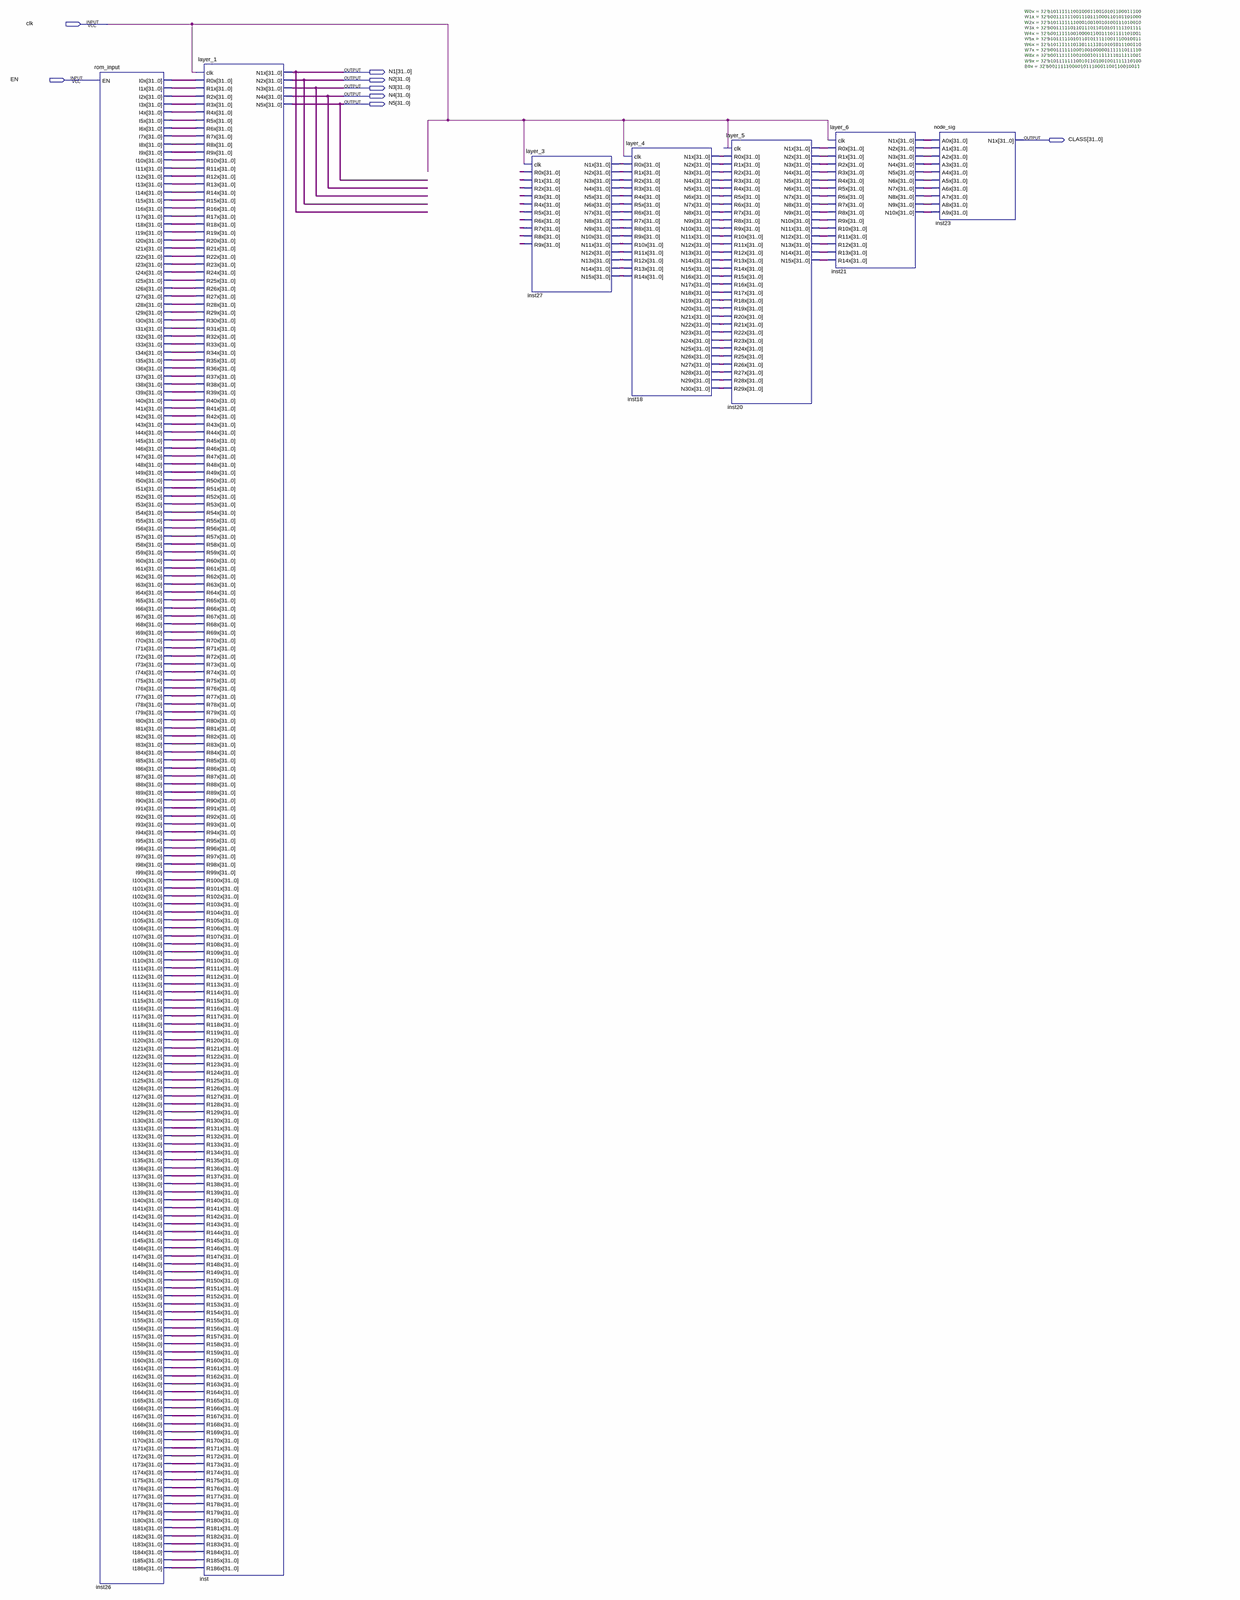
[diagram p0: schematic sheet, whole]
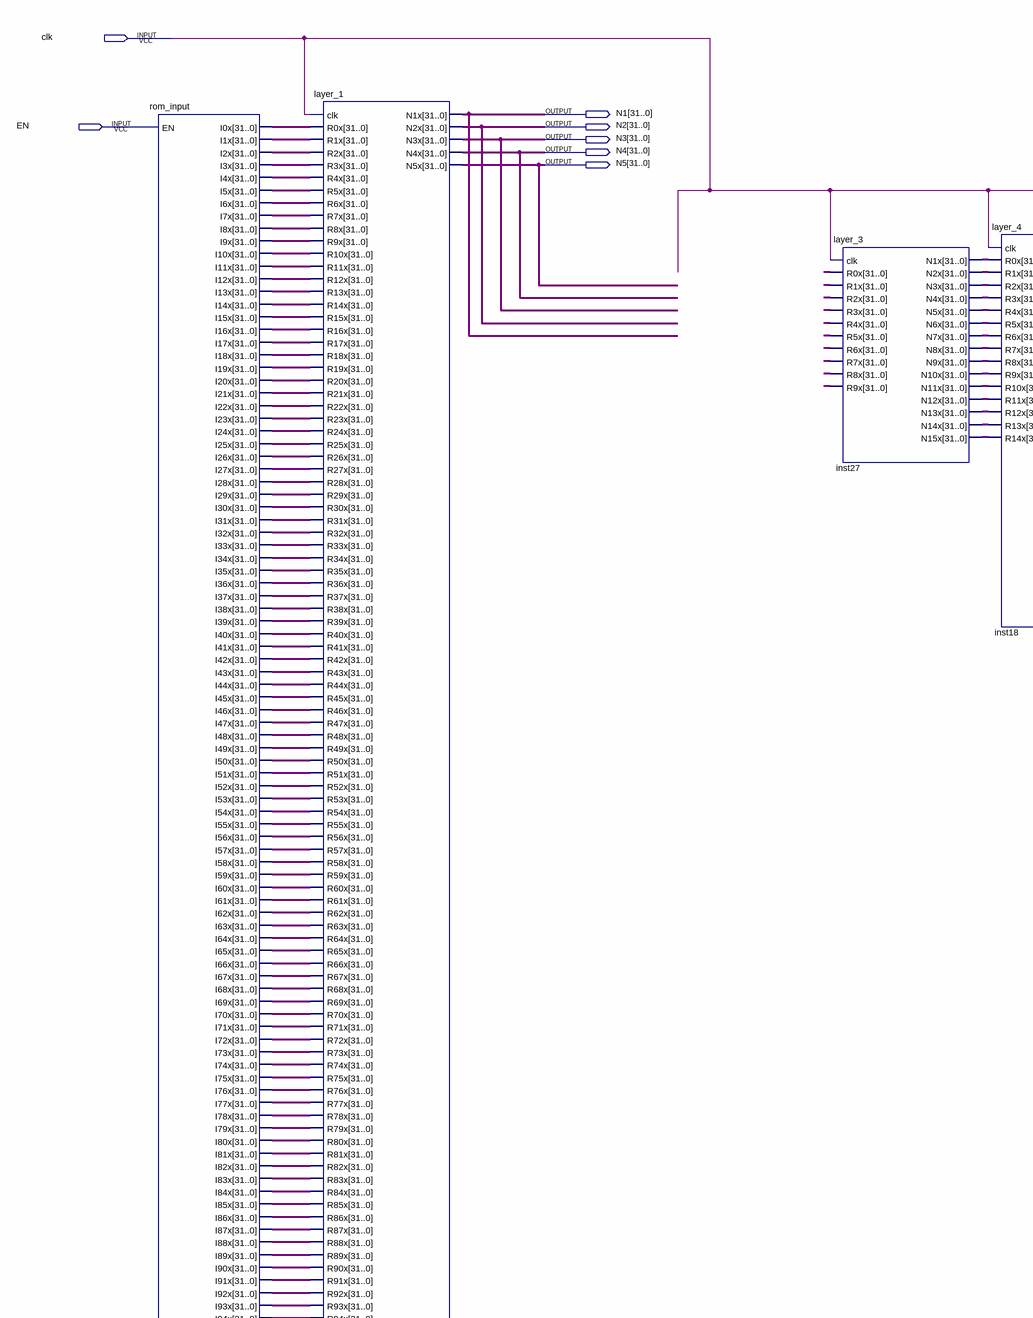
[diagram p1: schematic sheet, upper left part]
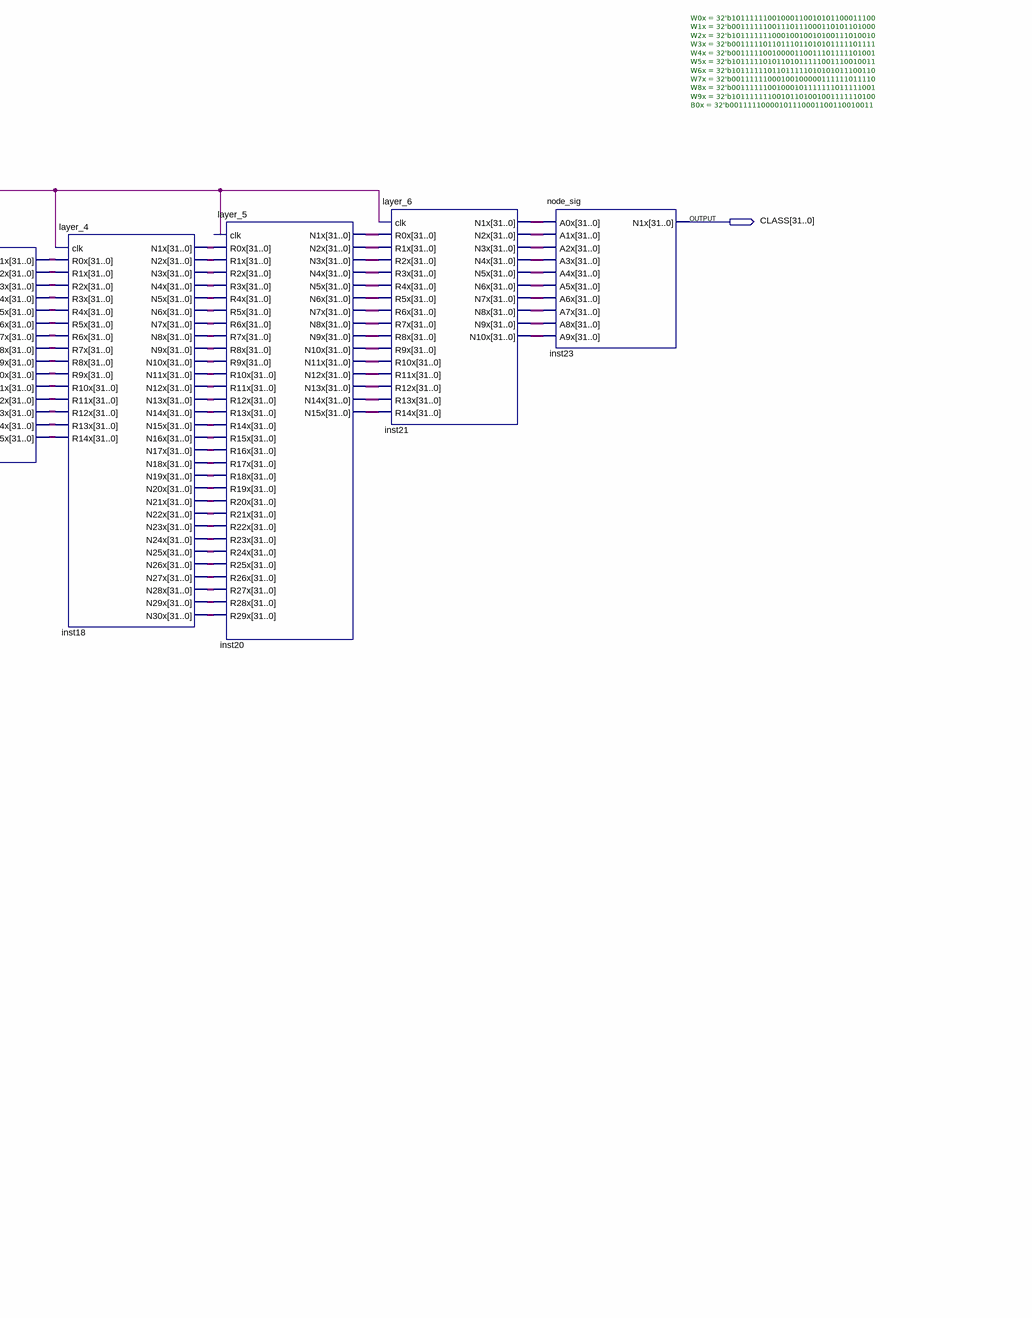
[diagram p2: schematic sheet, upper right part]
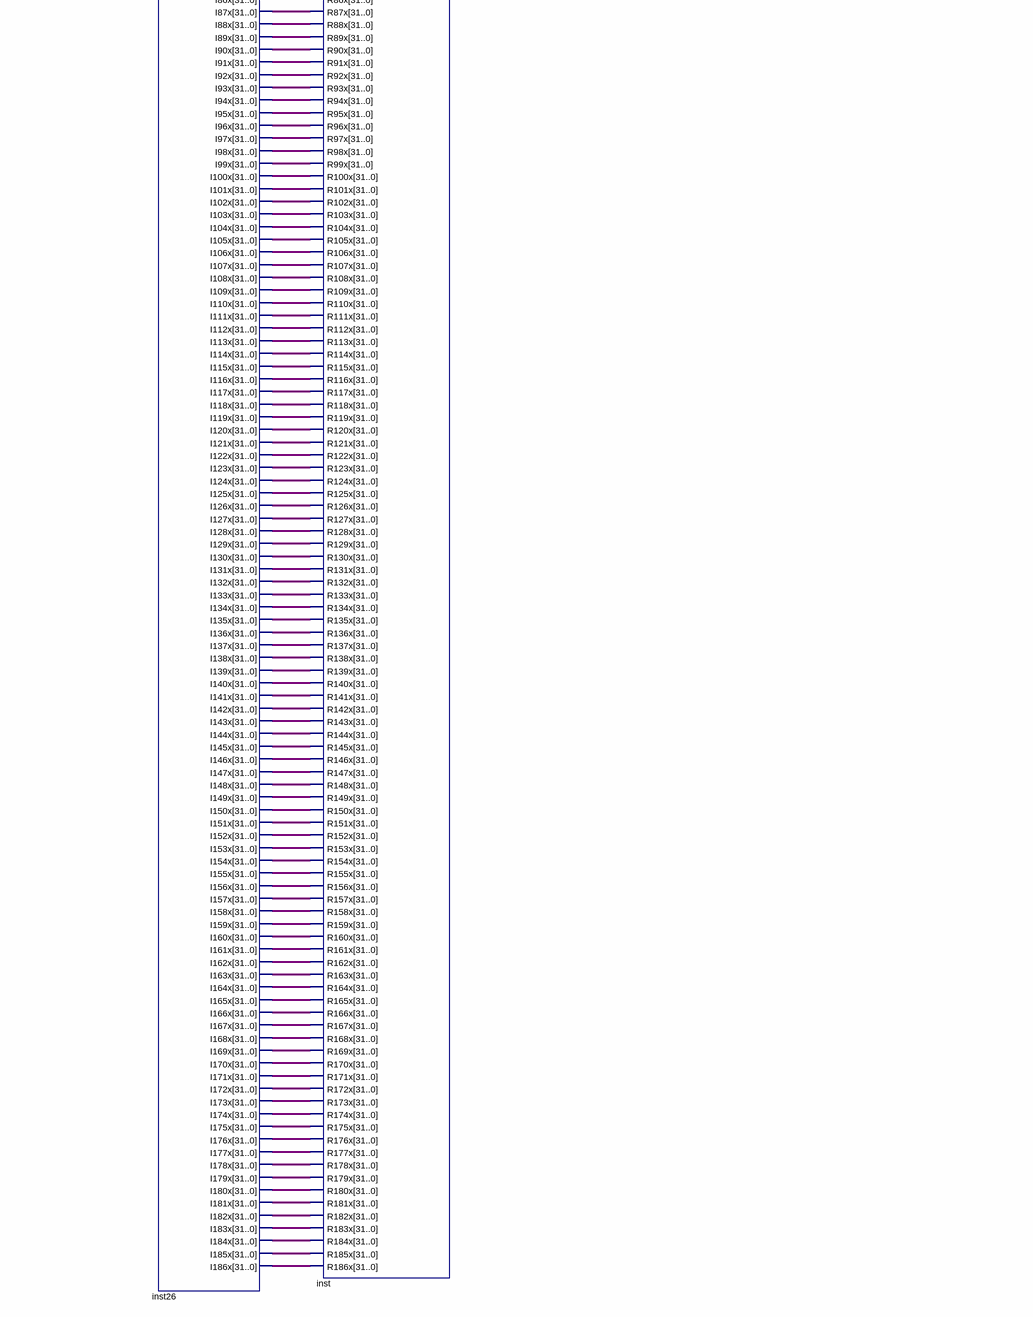
[diagram p3: schematic sheet, lower left part]
// Quartus schematic neural_net_top.bdf as structural Verilog: 7 symbols, 8 pins
module neural_net_top (
  input  clk,
  input  EN,
  output [31:0] N1,
  output [31:0] N2,
  output [31:0] N3,
  output [31:0] N4,
  output [31:0] N5,
  output [31:0] CLASS
);

  wire [31:0] inst18_n1x, inst18_n2x, inst18_n3x, inst18_n4x, inst18_n5x, inst18_n6x, inst18_n7x, inst18_n8x,
       inst18_n9x, inst18_n10x, inst18_n11x, inst18_n12x, inst18_n13x, inst18_n14x, inst18_n15x, inst18_n16x,
       inst18_n17x, inst18_n18x, inst18_n19x, inst18_n20x, inst18_n21x, inst18_n22x, inst18_n23x,
       inst18_n24x, inst18_n25x, inst18_n26x, inst18_n27x, inst18_n28x, inst18_n29x, inst18_n30x, inst20_n1x,
       inst20_n2x, inst20_n3x, inst20_n4x, inst20_n5x, inst20_n6x, inst20_n7x, inst20_n8x, inst20_n9x,
       inst20_n10x, inst20_n11x, inst20_n12x, inst20_n13x, inst20_n14x, inst20_n15x, inst21_n1x, inst21_n2x,
       inst21_n3x, inst21_n4x, inst21_n5x, inst21_n6x, inst21_n7x, inst21_n8x, inst21_n9x, inst21_n10x,
       inst26_i0x, inst26_i1x, inst26_i2x, inst26_i3x, inst26_i4x, inst26_i5x, inst26_i6x, inst26_i7x,
       inst26_i8x, inst26_i9x, inst26_i10x, inst26_i11x, inst26_i12x, inst26_i13x, inst26_i14x, inst26_i15x,
       inst26_i16x, inst26_i17x, inst26_i18x, inst26_i19x, inst26_i20x, inst26_i21x, inst26_i22x,
       inst26_i23x, inst26_i24x, inst26_i25x, inst26_i26x, inst26_i27x, inst26_i28x, inst26_i29x,
       inst26_i30x, inst26_i31x, inst26_i32x, inst26_i33x, inst26_i34x, inst26_i35x, inst26_i36x,
       inst26_i37x, inst26_i38x, inst26_i39x, inst26_i40x, inst26_i41x, inst26_i42x, inst26_i43x,
       inst26_i44x, inst26_i45x, inst26_i46x, inst26_i47x, inst26_i48x, inst26_i49x, inst26_i50x,
       inst26_i51x, inst26_i52x, inst26_i53x, inst26_i54x, inst26_i55x, inst26_i56x, inst26_i57x,
       inst26_i58x, inst26_i59x, inst26_i60x, inst26_i61x, inst26_i62x, inst26_i63x, inst26_i64x,
       inst26_i65x, inst26_i66x, inst26_i67x, inst26_i68x, inst26_i69x, inst26_i70x, inst26_i71x,
       inst26_i72x, inst26_i73x, inst26_i74x, inst26_i75x, inst26_i76x, inst26_i77x, inst26_i78x,
       inst26_i79x, inst26_i80x, inst26_i81x, inst26_i82x, inst26_i83x, inst26_i84x, inst26_i85x,
       inst26_i86x, inst26_i87x, inst26_i88x, inst26_i89x, inst26_i90x, inst26_i91x, inst26_i92x,
       inst26_i93x, inst26_i94x, inst26_i95x, inst26_i96x, inst26_i97x, inst26_i98x, inst26_i99x,
       inst26_i100x, inst26_i101x, inst26_i102x, inst26_i103x, inst26_i104x, inst26_i105x, inst26_i106x,
       inst26_i107x, inst26_i108x, inst26_i109x, inst26_i110x, inst26_i111x, inst26_i112x, inst26_i113x,
       inst26_i114x, inst26_i115x, inst26_i116x, inst26_i117x, inst26_i118x, inst26_i119x, inst26_i120x,
       inst26_i121x, inst26_i122x, inst26_i123x, inst26_i124x, inst26_i125x, inst26_i126x, inst26_i127x,
       inst26_i128x, inst26_i129x, inst26_i130x, inst26_i131x, inst26_i132x, inst26_i133x, inst26_i134x,
       inst26_i135x, inst26_i136x, inst26_i137x, inst26_i138x, inst26_i139x, inst26_i140x, inst26_i141x,
       inst26_i142x, inst26_i143x, inst26_i144x, inst26_i145x, inst26_i146x, inst26_i147x, inst26_i148x,
       inst26_i149x, inst26_i150x, inst26_i151x, inst26_i152x, inst26_i153x, inst26_i154x, inst26_i155x,
       inst26_i156x, inst26_i157x, inst26_i158x, inst26_i159x, inst26_i160x, inst26_i161x, inst26_i162x,
       inst26_i163x, inst26_i164x, inst26_i165x, inst26_i166x, inst26_i167x, inst26_i168x, inst26_i169x,
       inst26_i170x, inst26_i171x, inst26_i172x, inst26_i173x, inst26_i174x, inst26_i175x, inst26_i176x,
       inst26_i177x, inst26_i178x, inst26_i179x, inst26_i180x, inst26_i181x, inst26_i182x, inst26_i183x,
       inst26_i184x, inst26_i185x, inst26_i186x, inst27_n1x, inst27_n2x, inst27_n3x, inst27_n4x, inst27_n5x,
       inst27_n6x, inst27_n7x, inst27_n8x, inst27_n9x, inst27_n10x, inst27_n11x, inst27_n12x, inst27_n13x,
       inst27_n14x, inst27_n15x, undriven, undriven_2, undriven_3, undriven_4, undriven_5, undriven_6,
       undriven_7, undriven_8, undriven_9, undriven_10;

  rom_input inst26 (
    .EN(EN), .I0x(inst26_i0x), .I1x(inst26_i1x), .I2x(inst26_i2x), .I3x(inst26_i3x), .I4x(inst26_i4x),
    .I5x(inst26_i5x), .I6x(inst26_i6x), .I7x(inst26_i7x), .I8x(inst26_i8x), .I9x(inst26_i9x),
    .I10x(inst26_i10x), .I11x(inst26_i11x), .I12x(inst26_i12x), .I13x(inst26_i13x), .I14x(inst26_i14x),
    .I15x(inst26_i15x), .I16x(inst26_i16x), .I17x(inst26_i17x), .I18x(inst26_i18x), .I19x(inst26_i19x),
    .I20x(inst26_i20x), .I21x(inst26_i21x), .I22x(inst26_i22x), .I23x(inst26_i23x), .I24x(inst26_i24x),
    .I25x(inst26_i25x), .I26x(inst26_i26x), .I27x(inst26_i27x), .I28x(inst26_i28x), .I29x(inst26_i29x),
    .I30x(inst26_i30x), .I31x(inst26_i31x), .I32x(inst26_i32x), .I33x(inst26_i33x), .I34x(inst26_i34x),
    .I35x(inst26_i35x), .I36x(inst26_i36x), .I37x(inst26_i37x), .I38x(inst26_i38x), .I39x(inst26_i39x),
    .I40x(inst26_i40x), .I41x(inst26_i41x), .I42x(inst26_i42x), .I43x(inst26_i43x), .I44x(inst26_i44x),
    .I45x(inst26_i45x), .I46x(inst26_i46x), .I47x(inst26_i47x), .I48x(inst26_i48x), .I49x(inst26_i49x),
    .I50x(inst26_i50x), .I51x(inst26_i51x), .I52x(inst26_i52x), .I53x(inst26_i53x), .I54x(inst26_i54x),
    .I55x(inst26_i55x), .I56x(inst26_i56x), .I57x(inst26_i57x), .I58x(inst26_i58x), .I59x(inst26_i59x),
    .I60x(inst26_i60x), .I61x(inst26_i61x), .I62x(inst26_i62x), .I63x(inst26_i63x), .I64x(inst26_i64x),
    .I65x(inst26_i65x), .I66x(inst26_i66x), .I67x(inst26_i67x), .I68x(inst26_i68x), .I69x(inst26_i69x),
    .I70x(inst26_i70x), .I71x(inst26_i71x), .I72x(inst26_i72x), .I73x(inst26_i73x), .I74x(inst26_i74x),
    .I75x(inst26_i75x), .I76x(inst26_i76x), .I77x(inst26_i77x), .I78x(inst26_i78x), .I79x(inst26_i79x),
    .I80x(inst26_i80x), .I81x(inst26_i81x), .I82x(inst26_i82x), .I83x(inst26_i83x), .I84x(inst26_i84x),
    .I85x(inst26_i85x), .I86x(inst26_i86x), .I87x(inst26_i87x), .I88x(inst26_i88x), .I89x(inst26_i89x),
    .I90x(inst26_i90x), .I91x(inst26_i91x), .I92x(inst26_i92x), .I93x(inst26_i93x), .I94x(inst26_i94x),
    .I95x(inst26_i95x), .I96x(inst26_i96x), .I97x(inst26_i97x), .I98x(inst26_i98x), .I99x(inst26_i99x),
    .I100x(inst26_i100x), .I101x(inst26_i101x), .I102x(inst26_i102x), .I103x(inst26_i103x),
    .I104x(inst26_i104x), .I105x(inst26_i105x), .I106x(inst26_i106x), .I107x(inst26_i107x),
    .I108x(inst26_i108x), .I109x(inst26_i109x), .I110x(inst26_i110x), .I111x(inst26_i111x),
    .I112x(inst26_i112x), .I113x(inst26_i113x), .I114x(inst26_i114x), .I115x(inst26_i115x),
    .I116x(inst26_i116x), .I117x(inst26_i117x), .I118x(inst26_i118x), .I119x(inst26_i119x),
    .I120x(inst26_i120x), .I121x(inst26_i121x), .I122x(inst26_i122x), .I123x(inst26_i123x),
    .I124x(inst26_i124x), .I125x(inst26_i125x), .I126x(inst26_i126x), .I127x(inst26_i127x),
    .I128x(inst26_i128x), .I129x(inst26_i129x), .I130x(inst26_i130x), .I131x(inst26_i131x),
    .I132x(inst26_i132x), .I133x(inst26_i133x), .I134x(inst26_i134x), .I135x(inst26_i135x),
    .I136x(inst26_i136x), .I137x(inst26_i137x), .I138x(inst26_i138x), .I139x(inst26_i139x),
    .I140x(inst26_i140x), .I141x(inst26_i141x), .I142x(inst26_i142x), .I143x(inst26_i143x),
    .I144x(inst26_i144x), .I145x(inst26_i145x), .I146x(inst26_i146x), .I147x(inst26_i147x),
    .I148x(inst26_i148x), .I149x(inst26_i149x), .I150x(inst26_i150x), .I151x(inst26_i151x),
    .I152x(inst26_i152x), .I153x(inst26_i153x), .I154x(inst26_i154x), .I155x(inst26_i155x),
    .I156x(inst26_i156x), .I157x(inst26_i157x), .I158x(inst26_i158x), .I159x(inst26_i159x),
    .I160x(inst26_i160x), .I161x(inst26_i161x), .I162x(inst26_i162x), .I163x(inst26_i163x),
    .I164x(inst26_i164x), .I165x(inst26_i165x), .I166x(inst26_i166x), .I167x(inst26_i167x),
    .I168x(inst26_i168x), .I169x(inst26_i169x), .I170x(inst26_i170x), .I171x(inst26_i171x),
    .I172x(inst26_i172x), .I173x(inst26_i173x), .I174x(inst26_i174x), .I175x(inst26_i175x),
    .I176x(inst26_i176x), .I177x(inst26_i177x), .I178x(inst26_i178x), .I179x(inst26_i179x),
    .I180x(inst26_i180x), .I181x(inst26_i181x), .I182x(inst26_i182x), .I183x(inst26_i183x),
    .I184x(inst26_i184x), .I185x(inst26_i185x), .I186x(inst26_i186x));
  layer_1 inst (
    .clk(clk), .R0x(inst26_i0x), .R1x(inst26_i1x), .R2x(inst26_i2x), .R3x(inst26_i3x), .R4x(inst26_i4x),
    .R5x(inst26_i5x), .R6x(inst26_i6x), .R7x(inst26_i7x), .R8x(inst26_i8x), .R9x(inst26_i9x),
    .R10x(inst26_i10x), .R11x(inst26_i11x), .R12x(inst26_i12x), .R13x(inst26_i13x), .R14x(inst26_i14x),
    .R15x(inst26_i15x), .R16x(inst26_i16x), .R17x(inst26_i17x), .R18x(inst26_i18x), .R19x(inst26_i19x),
    .R20x(inst26_i20x), .R21x(inst26_i21x), .R22x(inst26_i22x), .R23x(inst26_i23x), .R24x(inst26_i24x),
    .R25x(inst26_i25x), .R26x(inst26_i26x), .R27x(inst26_i27x), .R28x(inst26_i28x), .R29x(inst26_i29x),
    .R30x(inst26_i30x), .R31x(inst26_i31x), .R32x(inst26_i32x), .R33x(inst26_i33x), .R34x(inst26_i34x),
    .R35x(inst26_i35x), .R36x(inst26_i36x), .R37x(inst26_i37x), .R38x(inst26_i38x), .R39x(inst26_i39x),
    .R40x(inst26_i40x), .R41x(inst26_i41x), .R42x(inst26_i42x), .R43x(inst26_i43x), .R44x(inst26_i44x),
    .R45x(inst26_i45x), .R46x(inst26_i46x), .R47x(inst26_i47x), .R48x(inst26_i48x), .R49x(inst26_i49x),
    .R50x(inst26_i50x), .R51x(inst26_i51x), .R52x(inst26_i52x), .R53x(inst26_i53x), .R54x(inst26_i54x),
    .R55x(inst26_i55x), .R56x(inst26_i56x), .R57x(inst26_i57x), .R58x(inst26_i58x), .R59x(inst26_i59x),
    .R60x(inst26_i60x), .R61x(inst26_i61x), .R62x(inst26_i62x), .R63x(inst26_i63x), .R64x(inst26_i64x),
    .R65x(inst26_i65x), .R66x(inst26_i66x), .R67x(inst26_i67x), .R68x(inst26_i68x), .R69x(inst26_i69x),
    .R70x(inst26_i70x), .R71x(inst26_i71x), .R72x(inst26_i72x), .R73x(inst26_i73x), .R74x(inst26_i74x),
    .R75x(inst26_i75x), .R76x(inst26_i76x), .R77x(inst26_i77x), .R78x(inst26_i78x), .R79x(inst26_i79x),
    .R80x(inst26_i80x), .R81x(inst26_i81x), .R82x(inst26_i82x), .R83x(inst26_i83x), .R84x(inst26_i84x),
    .R85x(inst26_i85x), .R86x(inst26_i86x), .R87x(inst26_i87x), .R88x(inst26_i88x), .R89x(inst26_i89x),
    .R90x(inst26_i90x), .R91x(inst26_i91x), .R92x(inst26_i92x), .R93x(inst26_i93x), .R94x(inst26_i94x),
    .R95x(inst26_i95x), .R96x(inst26_i96x), .R97x(inst26_i97x), .R98x(inst26_i98x), .R99x(inst26_i99x),
    .R100x(inst26_i100x), .R101x(inst26_i101x), .R102x(inst26_i102x), .R103x(inst26_i103x),
    .R104x(inst26_i104x), .R105x(inst26_i105x), .R106x(inst26_i106x), .R107x(inst26_i107x),
    .R108x(inst26_i108x), .R109x(inst26_i109x), .R110x(inst26_i110x), .R111x(inst26_i111x),
    .R112x(inst26_i112x), .R113x(inst26_i113x), .R114x(inst26_i114x), .R115x(inst26_i115x),
    .R116x(inst26_i116x), .R117x(inst26_i117x), .R118x(inst26_i118x), .R119x(inst26_i119x),
    .R120x(inst26_i120x), .R121x(inst26_i121x), .R122x(inst26_i122x), .R123x(inst26_i123x),
    .R124x(inst26_i124x), .R125x(inst26_i125x), .R126x(inst26_i126x), .R127x(inst26_i127x),
    .R128x(inst26_i128x), .R129x(inst26_i129x), .R130x(inst26_i130x), .R131x(inst26_i131x),
    .R132x(inst26_i132x), .R133x(inst26_i133x), .R134x(inst26_i134x), .R135x(inst26_i135x),
    .R136x(inst26_i136x), .R137x(inst26_i137x), .R138x(inst26_i138x), .R139x(inst26_i139x),
    .R140x(inst26_i140x), .R141x(inst26_i141x), .R142x(inst26_i142x), .R143x(inst26_i143x),
    .R144x(inst26_i144x), .R145x(inst26_i145x), .R146x(inst26_i146x), .R147x(inst26_i147x),
    .R148x(inst26_i148x), .R149x(inst26_i149x), .R150x(inst26_i150x), .R151x(inst26_i151x),
    .R152x(inst26_i152x), .R153x(inst26_i153x), .R154x(inst26_i154x), .R155x(inst26_i155x),
    .R156x(inst26_i156x), .R157x(inst26_i157x), .R158x(inst26_i158x), .R159x(inst26_i159x),
    .R160x(inst26_i160x), .R161x(inst26_i161x), .R162x(inst26_i162x), .R163x(inst26_i163x),
    .R164x(inst26_i164x), .R165x(inst26_i165x), .R166x(inst26_i166x), .R167x(inst26_i167x),
    .R168x(inst26_i168x), .R169x(inst26_i169x), .R170x(inst26_i170x), .R171x(inst26_i171x),
    .R172x(inst26_i172x), .R173x(inst26_i173x), .R174x(inst26_i174x), .R175x(inst26_i175x),
    .R176x(inst26_i176x), .R177x(inst26_i177x), .R178x(inst26_i178x), .R179x(inst26_i179x),
    .R180x(inst26_i180x), .R181x(inst26_i181x), .R182x(inst26_i182x), .R183x(inst26_i183x),
    .R184x(inst26_i184x), .R185x(inst26_i185x), .R186x(inst26_i186x), .N1x(N1), .N2x(N2), .N3x(N3), .N4x(N4),
    .N5x(N5));
  layer_3 inst27 (
    .clk(clk), .R0x(undriven), .R1x(undriven_2), .R2x(undriven_3), .R3x(undriven_4), .R4x(undriven_5),
    .R5x(undriven_6), .R6x(undriven_7), .R7x(undriven_8), .R8x(undriven_9), .R9x(undriven_10),
    .N1x(inst27_n1x), .N2x(inst27_n2x), .N3x(inst27_n3x), .N4x(inst27_n4x), .N5x(inst27_n5x),
    .N6x(inst27_n6x), .N7x(inst27_n7x), .N8x(inst27_n8x), .N9x(inst27_n9x), .N10x(inst27_n10x),
    .N11x(inst27_n11x), .N12x(inst27_n12x), .N13x(inst27_n13x), .N14x(inst27_n14x), .N15x(inst27_n15x));
  layer_4 inst18 (
    .clk(clk), .R0x(inst27_n1x), .R1x(inst27_n2x), .R2x(inst27_n3x), .R3x(inst27_n4x), .R4x(inst27_n5x),
    .R5x(inst27_n6x), .R6x(inst27_n7x), .R7x(inst27_n8x), .R8x(inst27_n9x), .R9x(inst27_n10x),
    .R10x(inst27_n11x), .R11x(inst27_n12x), .R12x(inst27_n13x), .R13x(inst27_n14x), .R14x(inst27_n15x),
    .N1x(inst18_n1x), .N2x(inst18_n2x), .N3x(inst18_n3x), .N4x(inst18_n4x), .N5x(inst18_n5x),
    .N6x(inst18_n6x), .N7x(inst18_n7x), .N8x(inst18_n8x), .N9x(inst18_n9x), .N10x(inst18_n10x),
    .N11x(inst18_n11x), .N12x(inst18_n12x), .N13x(inst18_n13x), .N14x(inst18_n14x), .N15x(inst18_n15x),
    .N16x(inst18_n16x), .N17x(inst18_n17x), .N18x(inst18_n18x), .N19x(inst18_n19x), .N20x(inst18_n20x),
    .N21x(inst18_n21x), .N22x(inst18_n22x), .N23x(inst18_n23x), .N24x(inst18_n24x), .N25x(inst18_n25x),
    .N26x(inst18_n26x), .N27x(inst18_n27x), .N28x(inst18_n28x), .N29x(inst18_n29x), .N30x(inst18_n30x));
  layer_5 inst20 (
    .R0x(inst18_n1x), .R1x(inst18_n2x), .R2x(inst18_n3x), .R3x(inst18_n4x), .R4x(inst18_n5x),
    .R5x(inst18_n6x), .R6x(inst18_n7x), .R7x(inst18_n8x), .R8x(inst18_n9x), .R9x(inst18_n10x),
    .R10x(inst18_n11x), .R11x(inst18_n12x), .R12x(inst18_n13x), .R13x(inst18_n14x), .R14x(inst18_n15x),
    .R15x(inst18_n16x), .R16x(inst18_n17x), .R17x(inst18_n18x), .R18x(inst18_n19x), .R19x(inst18_n20x),
    .R20x(inst18_n21x), .R21x(inst18_n22x), .R22x(inst18_n23x), .R23x(inst18_n24x), .R24x(inst18_n25x),
    .R25x(inst18_n26x), .R26x(inst18_n27x), .R27x(inst18_n28x), .R28x(inst18_n29x), .R29x(inst18_n30x),
    .N1x(inst20_n1x), .N2x(inst20_n2x), .N3x(inst20_n3x), .N4x(inst20_n4x), .N5x(inst20_n5x),
    .N6x(inst20_n6x), .N7x(inst20_n7x), .N8x(inst20_n8x), .N9x(inst20_n9x), .N10x(inst20_n10x),
    .N11x(inst20_n11x), .N12x(inst20_n12x), .N13x(inst20_n13x), .N14x(inst20_n14x), .N15x(inst20_n15x));  // open: clk
  layer_6 inst21 (
    .clk(clk), .R0x(inst20_n1x), .R1x(inst20_n2x), .R2x(inst20_n3x), .R3x(inst20_n4x), .R4x(inst20_n5x),
    .R5x(inst20_n6x), .R6x(inst20_n7x), .R7x(inst20_n8x), .R8x(inst20_n9x), .R9x(inst20_n10x),
    .R10x(inst20_n11x), .R11x(inst20_n12x), .R12x(inst20_n13x), .R13x(inst20_n14x), .R14x(inst20_n15x),
    .N1x(inst21_n1x), .N2x(inst21_n2x), .N3x(inst21_n3x), .N4x(inst21_n4x), .N5x(inst21_n5x),
    .N6x(inst21_n6x), .N7x(inst21_n7x), .N8x(inst21_n8x), .N9x(inst21_n9x), .N10x(inst21_n10x));
  node_sig #(.W0x(32'b10111111001000110010101100011100), .W1x(32'b00111111001110111000110101101000), .W2x(32'b10111111100010010010100111010010), .W3x(32'b00111110110111011010101111101111), .W4x(32'b00111110010000110011101111101001), .W5x(32'b10111110101101011111001110010011), .W6x(32'b10111111011011111010101011100110), .W7x(32'b00111111000100100000111111011110), .W8x(32'b00111111001000101111111011111001), .W9x(32'b10111111100101101001001111110100), .B0x(32'b00111110000101110001100110010011)) inst23 (
    .A0x(inst21_n1x), .A1x(inst21_n2x), .A2x(inst21_n3x), .A3x(inst21_n4x), .A4x(inst21_n5x),
    .A5x(inst21_n6x), .A6x(inst21_n7x), .A7x(inst21_n8x), .A8x(inst21_n9x), .A9x(inst21_n10x), .N1x(CLASS));
endmodule
